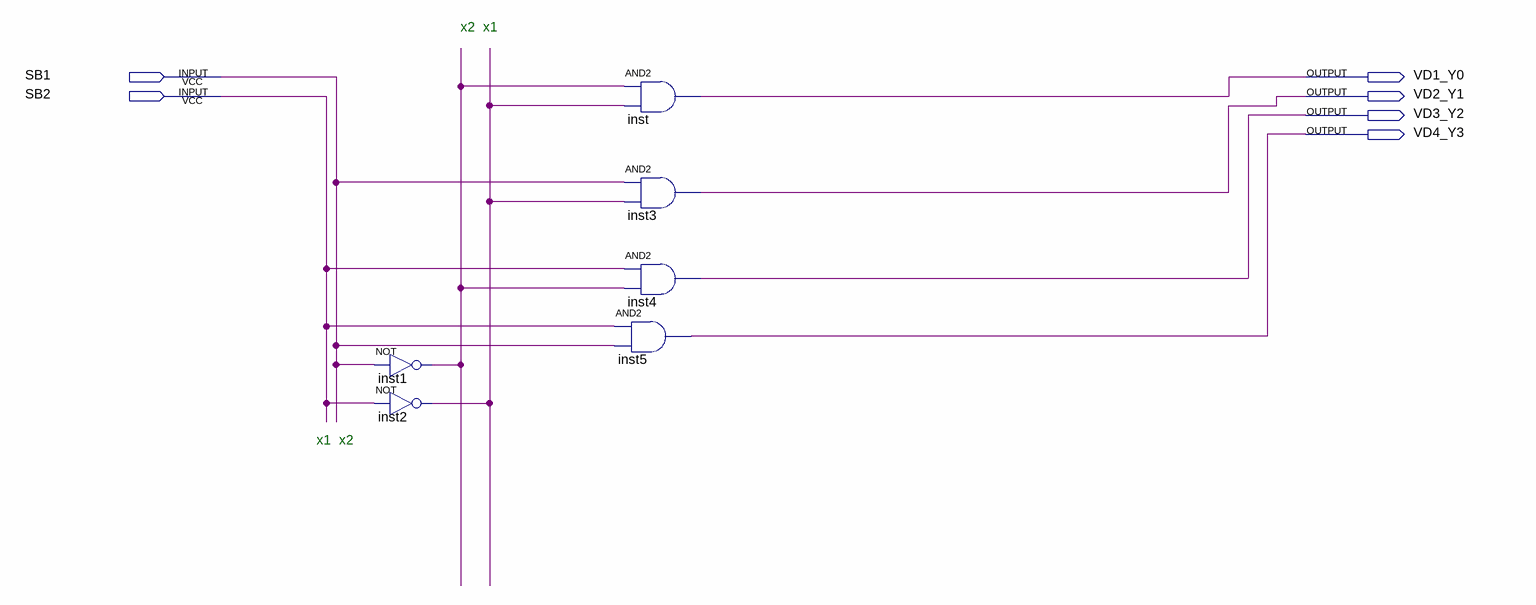
[diagram p0: schematic sheet]
// Quartus schematic project2a.bdf as structural Verilog: 6 symbols, 6 pins
module project2a (
  input  SB1,
  input  SB2,
  output VD1_Y0,
  output VD2_Y1,
  output VD3_Y2,
  output VD4_Y3
);

  wire inst1_out, inst2_out;

  not inst1 (inst1_out, SB1);
  not inst2 (inst2_out, SB2);
  and inst (VD1_Y0, inst1_out, inst2_out);
  and inst3 (VD2_Y1, SB1, inst2_out);
  and inst4 (VD3_Y2, SB2, inst1_out);
  and inst5 (VD4_Y3, SB2, SB1);

  // Notes on the sheet:
  //   x2  x1
  //   x1  x2
endmodule
